# EAGLE design CM_VGA (EAGLE 5.04)
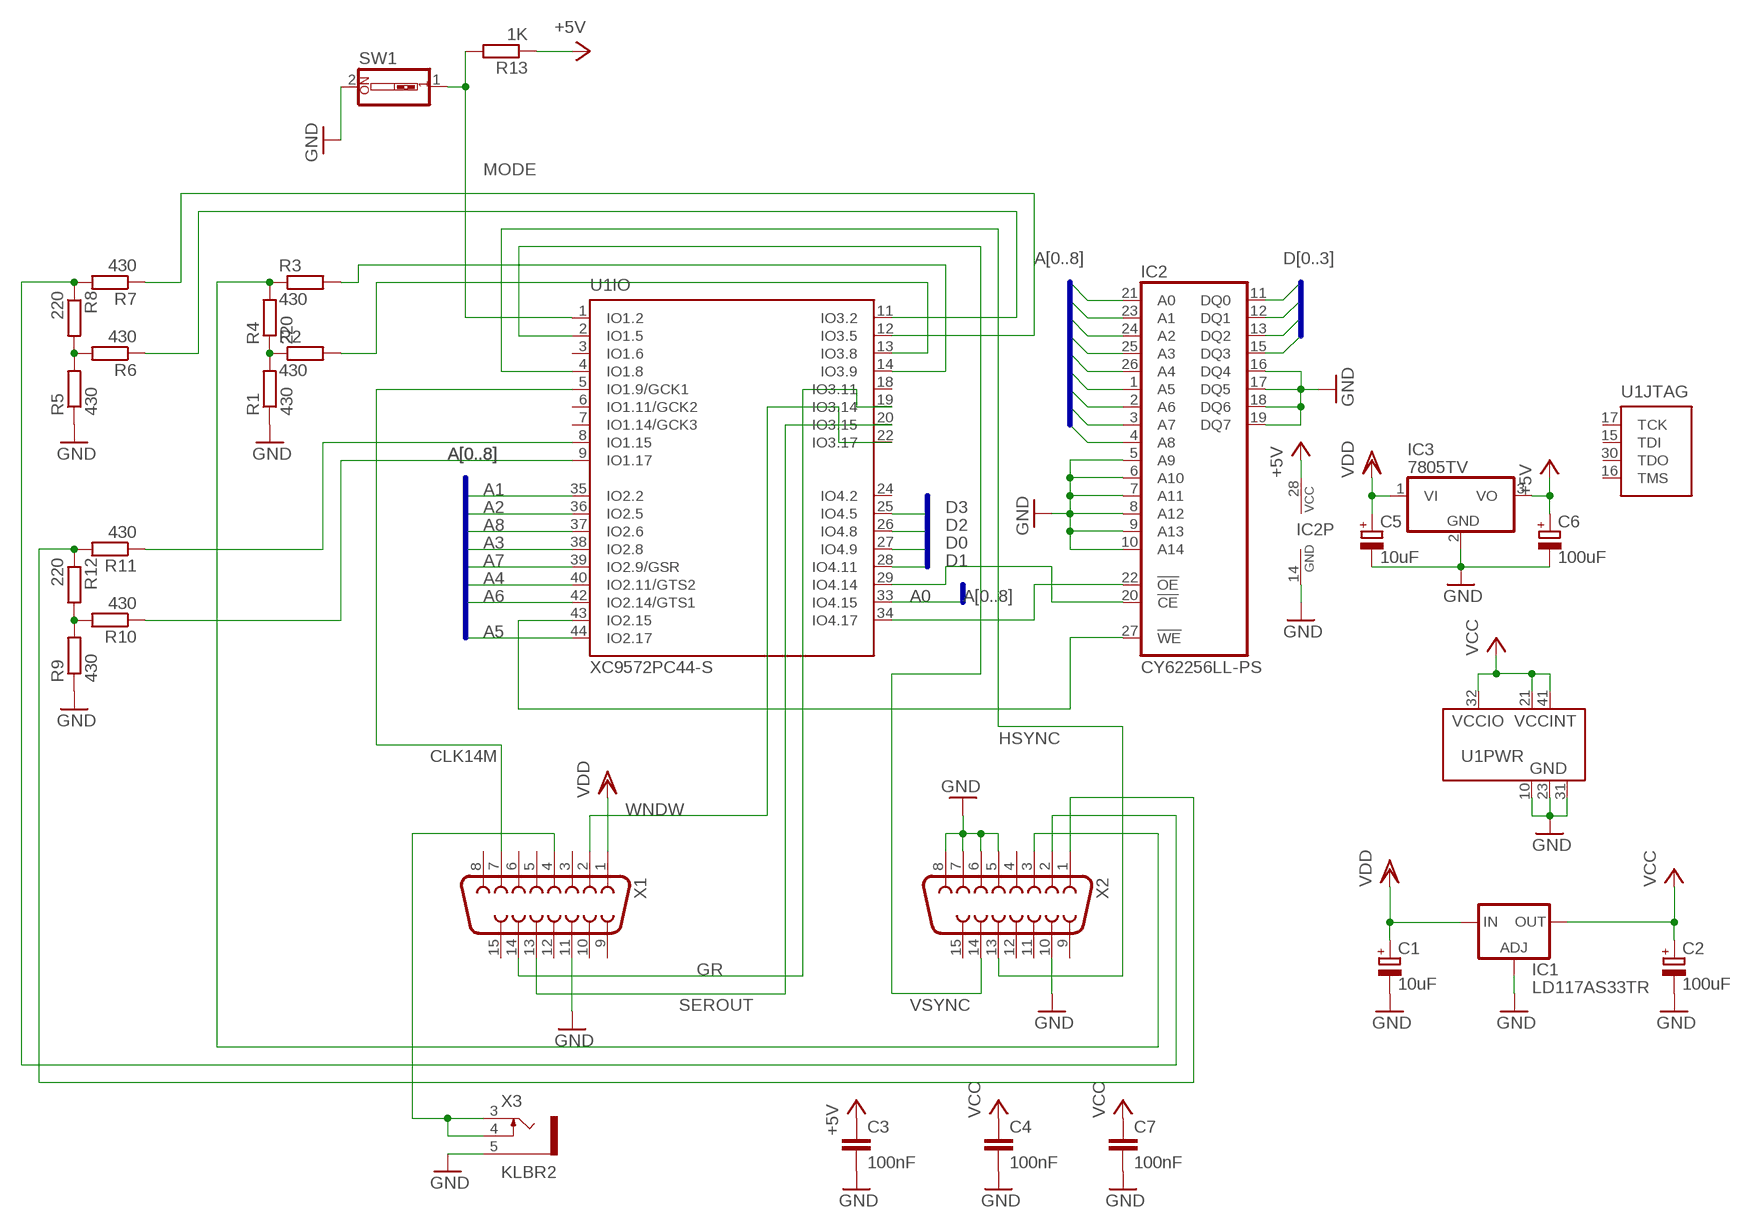
[diagram p0: schematic, sheet 1]

## Parts
C1  10uF  CPOL-EUE2.5-7  [E2,5-7]
C2  100uF  CPOL-EUE2.5-7  [E2,5-7]
C3  100nF  C-EU050-024X044  [C050-024X044]
C4  100nF  C-EU050-024X044  [C050-024X044]
C5  10uF  CPOL-EUE2.5-7  [E2,5-7]
C6  100uF  CPOL-EUE2.5-7  [E2,5-7]
C7  100nF  C-EU050-024X044  [C050-024X044]
IC1  LD117AS33TR  [SOT223]
IC2  CY62256LL-PS  [DIL28-3]
IC3  7805TV  [TO220V]
R1  430  R-EU_0204/7  [0204/7]
R2  430  R-EU_0204/7  [0204/7]
R3  430  R-EU_0204/7  [0204/7]
R4  220  R-EU_0204/7  [0204/7]
R5  430  R-EU_0204/7  [0204/7]
R6  430  R-EU_0204/7  [0204/7]
R7  430  R-EU_0204/7  [0204/7]
R8  220  R-EU_0204/7  [0204/7]
R9  430  R-EU_0204/7  [0204/7]
R10  430  R-EU_0204/7  [0204/7]
R11  430  R-EU_0204/7  [0204/7]
R12  220  R-EU_0204/7  [0204/7]
R13  1K  R-EU_0204/7  [0204/7]
SW1  SW_DIP-1  [EDG-01]
U1  XC9572PC44-S  [PLCC44S]
X1  F15H  [F15H]
X2  F15HDH  [HDF15H]
X3  KLBR2  [KLBR2]

## Nets
+5V: C3.1 C6.+ IC2.28(VCC) IC3.3(VO) R13.1
A0: IC2.21(A0) U1.33(IO:IO4.15)
A1: IC2.23(A1) U1.35(IO:IO2.2)
A2: IC2.24(A2) U1.36(IO:IO2.5)
A3: IC2.25(A3) U1.38(IO:IO2.8)
A4: IC2.26(A4) U1.40(IO:IO2.11/GTS2)
A5: IC2.1(A5) U1.44(IO:IO2.17)
A6: IC2.2(A6) U1.42(IO:IO2.14/GTS1)
A7: IC2.3(A7) U1.39(IO:IO2.9/GSR)
A8: IC2.4(A8) U1.37(IO:IO2.6)
CLK14M: U1.5(IO:IO1.9/GCK1) X1.7
D0: IC2.11(DQ0) U1.27(IO:IO4.9)
D1: IC2.12(DQ1) U1.28(IO:IO4.11)
D2: IC2.13(DQ2) U1.26(IO:IO4.8)
D3: IC2.15(DQ3) U1.25(IO:IO4.5)
GND: C1.- C2.- C3.2 C4.2 C5.- C6.- C7.2 IC1.1(ADJ) IC2.5(A9) IC2.6(A10) IC2.7(A11) IC2.8(A12) IC2.9(A13) IC2.10(A14) IC2.14(GND) IC2.16(DQ4) IC2.17(DQ5) IC2.18(DQ6) IC2.19(DQ7) IC3.2(GND) R1.1 R5.1 R9.1 SW1.2 U1.10(PWR:GND) U1.23(PWR:GND) U1.31(PWR:GND) X1.11 X2.5 X2.6 X2.7 X2.8 X2.10 X3.5
GR: U1.19(IO:IO3.14) X1.14
HSYNC: U1.4(IO:IO1.8) X2.13
MODE: R13.2 SW1.1 U1.1(IO:IO1.2)
N$1: IC2.27(!WE) U1.43(IO:IO2.15)
N$2: IC2.22(!OE) U1.34(IO:IO4.17)
N$3: IC2.20(!CE) U1.29(IO:IO4.14)
N$5: R1.2 R2.1 R4.1
N$6: R3.1 R4.2 X2.3
N$7: R5.2 R6.2 R8.2
N$8: R7.2 R8.1 X2.2
N$9: R9.2 R10.2 R12.2
N$10: R11.2 R12.1 X2.1
N$11: X1.4 X3.3 X3.4
N$12: R2.2 U1.13(IO:IO3.8)
N$13: R3.2 U1.14(IO:IO3.9)
N$14: R11.1 U1.8(IO:IO1.15)
N$15: R6.1 U1.11(IO:IO3.2)
N$16: R7.1 U1.12(IO:IO3.5)
N$17: R10.1 U1.9(IO:IO1.17)
SEROUT: U1.20(IO:IO3.15) X1.13
VCC: C2.+ C4.1 C7.1 IC1.4(OUT) U1.21(PWR:VCCINT) U1.32(PWR:VCCIO) U1.41(PWR:VCCINT)
VDD: C1.+ C5.+ IC1.3(IN) IC3.1(VI) X1.1
VSYNC: U1.2(IO:IO1.5) X2.14
WNDW: U1.22(IO:IO3.17) X1.2
Unconnected: U1.3(IO:IO1.6) U1.6(IO:IO1.11/GCK2) U1.7(IO:IO1.14/GCK3) U1.15(JTAG:TDI) U1.16(JTAG:TMS) U1.17(JTAG:TCK) U1.18(IO:IO3.11) U1.24(IO:IO4.2) U1.30(JTAG:TDO) X1.3 X1.5 X1.6 X1.8 X1.9 X1.10 X1.12 X1.15 X2.4 X2.9 X2.11 X2.12 X2.15

## Buses
A[0..8]
D[0..3]

## Library data of the parts
C1 C2 C5 C6 = rcl:CPOL-EU: POLARIZED CAPACITOR, European symbol
C3 C4 C7 = rcl:C-EU: CAPACITOR, European symbol
IC1 = v-reg:LD117A?*: Low drop fixed and adjustable positive voltage regulators 1 A Source: http://www.st.com/stonline/products/literature/ds/7194/ld1117axx.pdf
IC2 = greg-memory-sram:CY62256LL-?*: 256K (32K x 8) CMOS-Static RAM Source: http://download.cypress.com.edgesuite.net/design_resources/datasheets/contents/cy62256_8.pdf
IC3 = linear:78*: Positive VOLTAGE REGULATOR Source: http://cache.national.com/ds/LM/LM78L05.pdf http://www.fairchildsemi.com/ds/LM/LM7805.pdf
R1-R13 = rcl:R-EU_: RESISTOR, European symbol
SW1 = special:SW_DIP-1: DIP SWITCH
U1 = apbteam_xilinx-cpld:XC9572*PC44: XC9572 In-System Programmable CPLD 72 macrocells
X1 X2 = con-subd:F15: SUB-D
X3 = con-lumberg:KLBR?: Jack connectors according to JISC 6560, 2.5mm / 3.5 mm Klinkensteckverbinder nach JISC 6560, 2.5mm / 3,5 mm Source: http://www.lumberg.com/Produkte/PDFs/KLBR2.pdf www.lumberg.com/Produkte/PDFs/KLBR1.pdf

## Board
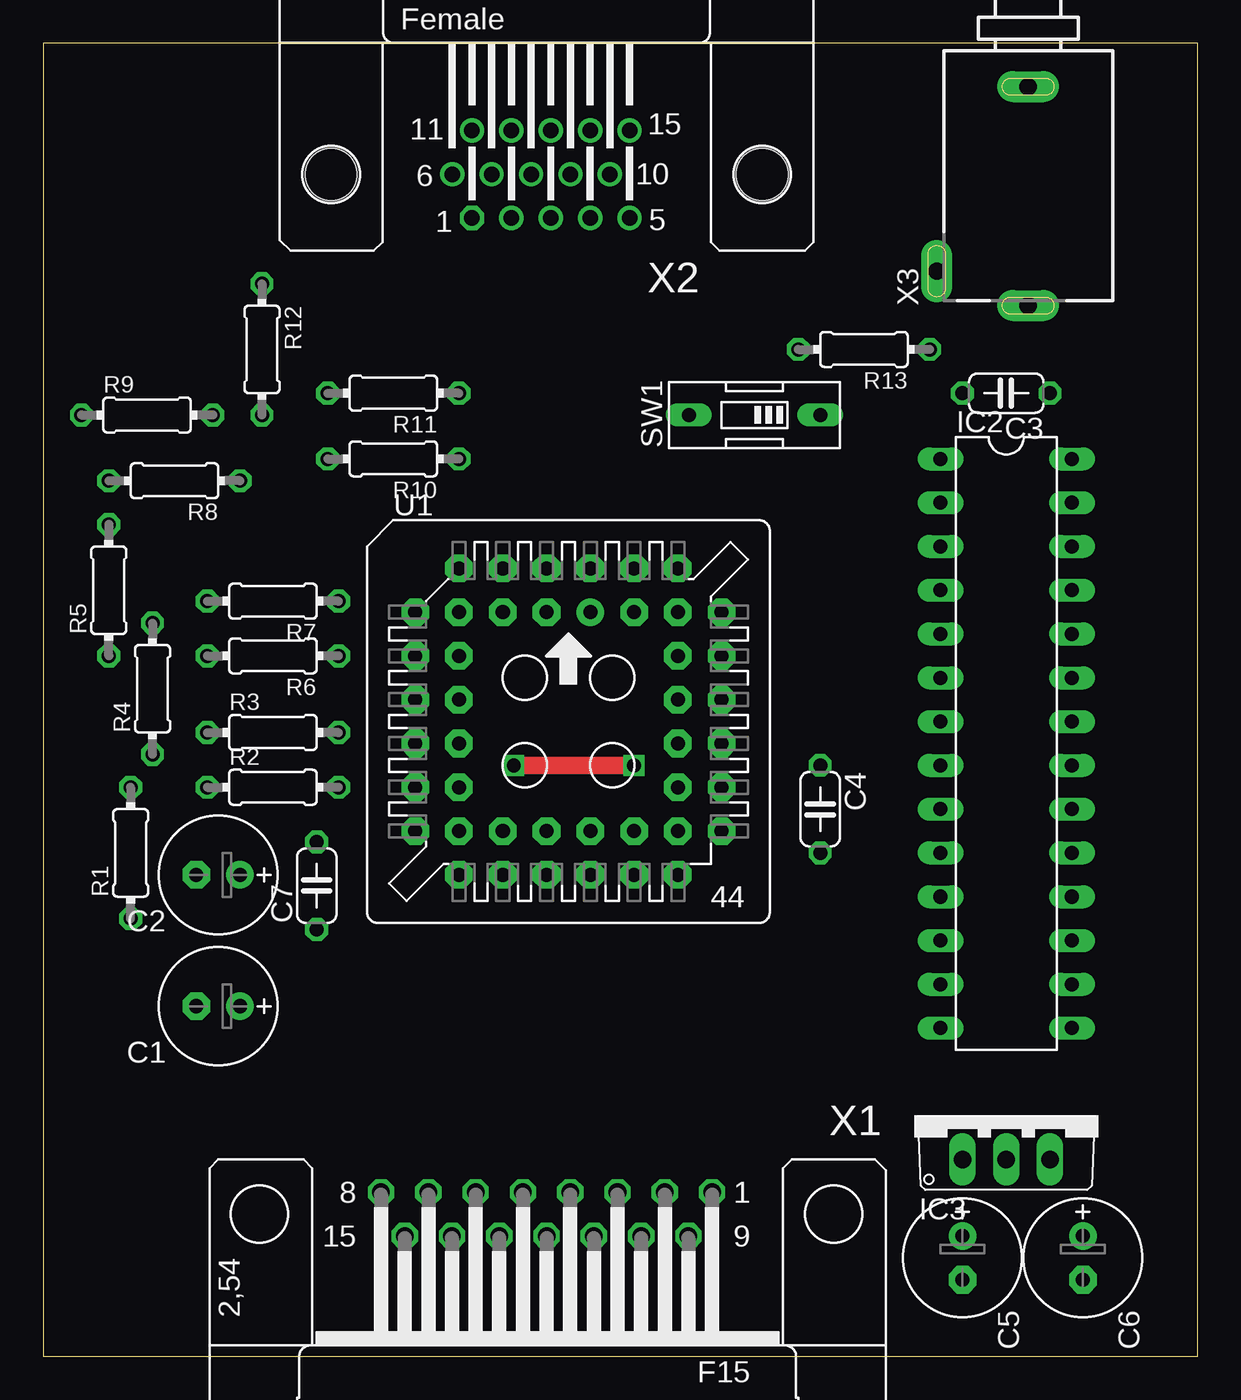
[diagram p1: board, top side]
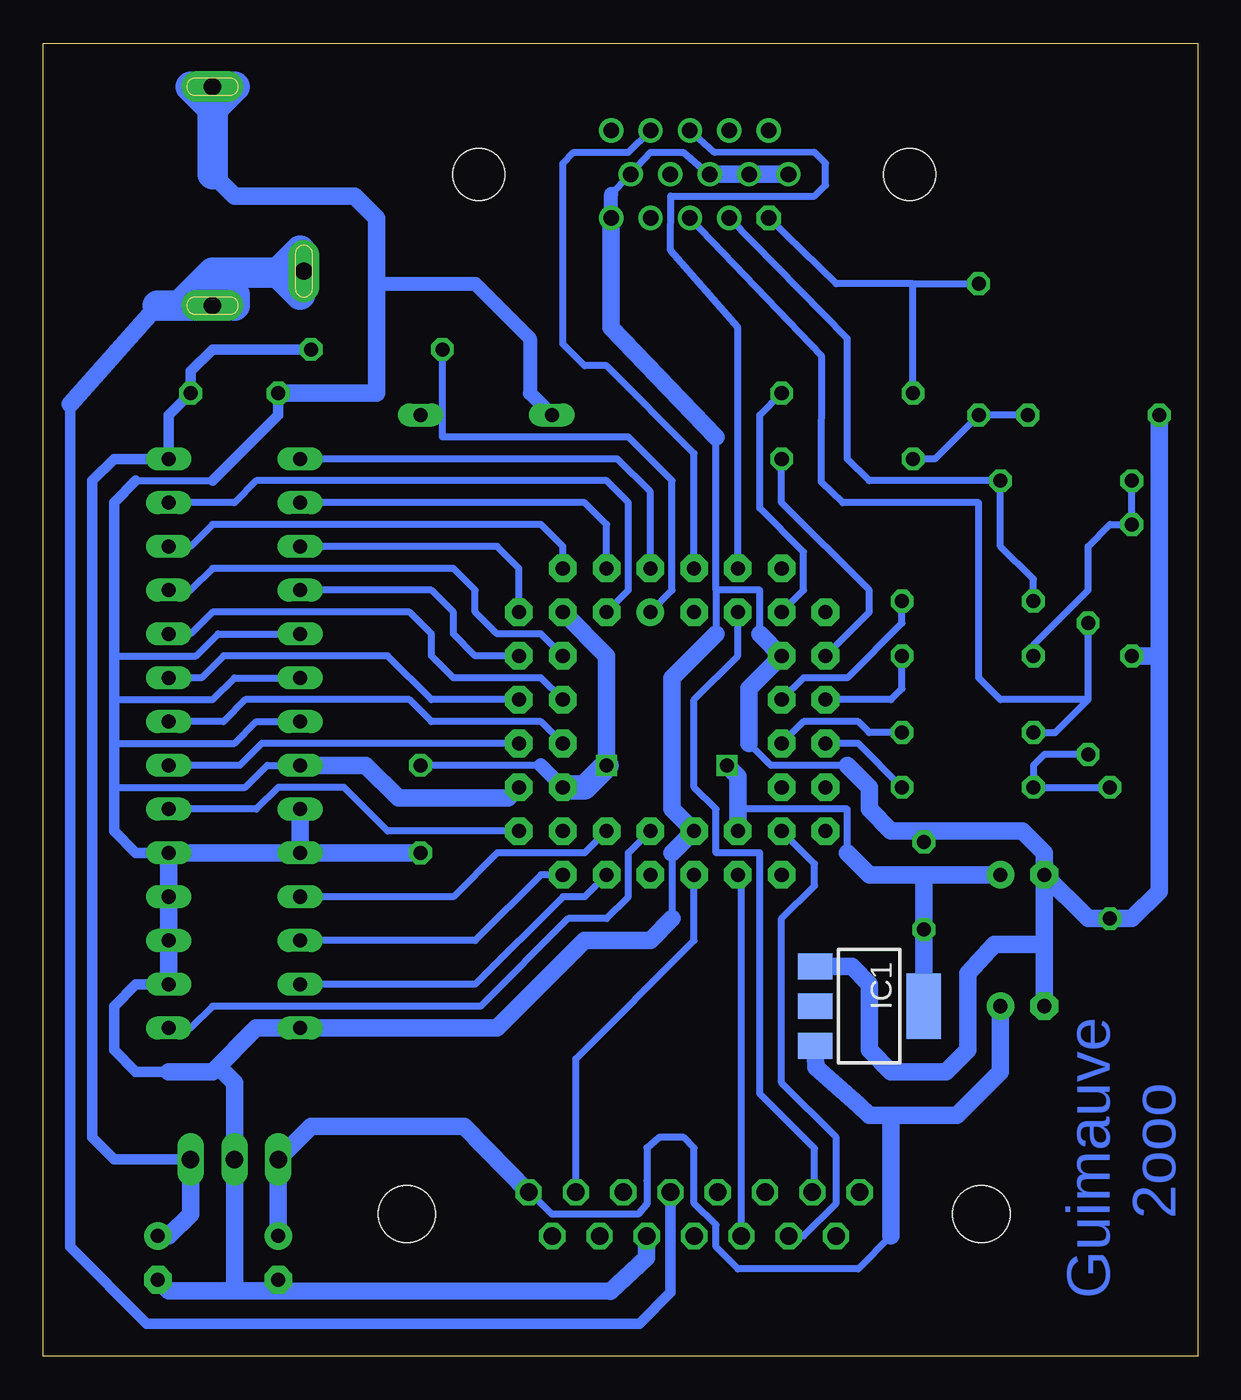
[diagram p2: board, bottom side, seen from below]

Size 66.98 x 76.19 mm. Coordinates in mm from the lower left corner, seen from the top.
Outline: 0,0 66.98,0 66.98,76.19 0,76.19 0,0
Copper layers (1*16): Top 0.035mm / dielectric 1.5mm / Bottom 0.035mm
Design rules "default": minimum track width 10mil, minimum drill 24mil, track to track 8mil, track to pad 8mil, pad to pad 8mil, via to via 8mil, smd to smd 8mil, copper to edge 40mil, drill to drill 8mil, minimum pad ring 10mil, minimum via ring 8mil, stop-mask expansion 4mil, vias tented up to drill 0mil, thermal gap 10mil

### Footprints (pad centres in the part's own frame; a part is rotated, then mirrored left to right if it is on the bottom)
E2,5-7 = drill 0.813 pad 1.6 round: + -1.27,0 | drill 0.813 pad 1.6 octagon: - 1.27,0
C050-024X044 = drill 0.813 octagon: 1 -2.54,0; 2 2.54,0
SOT223 = smd 1.5 x 2: 1 -2.3,-3.15; 2 0,-3.15; 3 2.3,-3.15 | smd 3.8 x 2: 4 0,3.15
DIL28-3 = drill 0.813 long: 1 -16.51,-3.81; 2 -13.97,-3.81; 3 -11.43,-3.81; 4 -8.89,-3.81; 5 -6.35,-3.81; 6 -3.81,-3.81; 7 -1.27,-3.81; 8 1.27,-3.81; 9 3.81,-3.81; 10 6.35,-3.81; 11 8.89,-3.81; 12 11.43,-3.81; 13 13.97,-3.81; 14 16.51,-3.81; 15 16.51,3.81; 16 13.97,3.81; 17 11.43,3.81; 18 8.89,3.81; 19 6.35,3.81; 20 3.81,3.81; 21 1.27,3.81; 22 -1.27,3.81; 23 -3.81,3.81; 24 -6.35,3.81; 25 -8.89,3.81; 26 -11.43,3.81; 27 -13.97,3.81; 28 -16.51,3.81
TO220V = drill 1.016 long: 1 -2.54,-2.54; 2 0,-2.54; 3 2.54,-2.54
0204/7 = drill 0.813 octagon: 1 -3.81,0; 2 3.81,0
EDG-01 = drill 0.813 long: 1 0,-3.81; 2 0,3.81
PLCC44S = drill 0.813 pad 1.6 round: 1 1.27,6.35 | drill 0.813 pad 1.6 octagon: 2 -1.27,8.89; 3 -1.27,6.35; 4 -3.81,8.89; 5 -3.81,6.35; 6 -6.35,8.89; 7 -8.89,6.35; 8 -6.35,6.35; 9 -8.89,3.81; 10 -6.35,3.81; 11 -8.89,1.27; 12 -6.35,1.27; 13 -8.89,-1.27; 14 -6.35,-1.27; 15 -8.89,-3.81; 16 -6.35,-3.81; 17 -8.89,-6.35; 18 -6.35,-8.89; 19 -6.35,-6.35; 20 -3.81,-8.89; 21 -3.81,-6.35; 22 -1.27,-8.89; 23 -1.27,-6.35; 24 1.27,-8.89; 25 1.27,-6.35; 26 3.81,-8.89; 27 3.81,-6.35; 28 6.35,-8.89; 29 8.89,-6.35; 30 6.35,-6.35; 31 8.89,-3.81; 32 6.35,-3.81; 33 8.89,-1.27; 34 6.35,-1.27; 35 8.89,1.27; 36 6.35,1.27; 37 8.89,3.81; 38 6.35,3.81; 39 8.89,6.35; 40 6.35,8.89; 41 6.35,6.35; 42 3.81,8.89; 43 3.81,6.35; 44 1.27,8.89
F15H = drill 1.016 octagon: 1 -9.601,-1.27; 2 -6.858,-1.27; 3 -4.115,-1.27; 4 -1.372,-1.27; 5 1.372,-1.27; 6 4.115,-1.27; 7 6.858,-1.27; 8 9.601,-1.27; 9 -8.23,1.27; 10 -5.486,1.27; 11 -2.743,1.27; 12 0,1.27; 13 2.743,1.27; 14 5.486,1.27; 15 8.23,1.27 | hole 3.302: -16.662,0; 16.662,0
HDF15H = drill 0.9 octagon: 1 4.329,2.54 | drill 0.9 round: 2 2.043,2.54; 3 -0.243,2.54; 4 -2.529,2.54; 5 -4.815,2.54; 6 5.472,0; 7 3.186,0; 8 0.9,0; 9 -1.386,0; 10 -3.672,0; 11 4.329,-2.54; 12 2.043,-2.54; 13 -0.243,-2.54; 14 -2.529,-2.54; 15 -4.815,-2.54 | hole 3: -12.5,0; 12.5,0
KLBR2 = drill 1 pad 1.8 long: 3 0,-6.35; 4 -5.3,-4.35; 5 0,6.35

### Placement (x,y rotation side)
C1  10.16,20.32 180 top
C2  10.16,27.94 180 top
C3  55.88,55.88 180 top
C4  45.09,31.75 270 top
C5  53.34,5.72 270 top
C6  60.32,5.72 270 top
C7  15.88,27.3 90 top
IC1  19.05,20.32 270 bottom
IC2  55.88,35.56 270 top
IC3  55.88,13.97 0 top
R1  5.08,29.21 90 top
R2  13.34,33.02 0 top
R3  13.34,36.2 0 top
R4  6.35,38.73 90 top
R5  3.81,44.45 90 top
R6  13.34,40.64 180 top
R7  13.34,43.81 180 top
R8  7.62,50.8 180 top
R9  6.03,54.61 0 top
R10  20.32,52.07 180 top
R11  20.32,55.88 180 top
R12  12.7,58.42 270 top
R13  47.62,58.42 180 top
SW1  41.27,54.61 90 top
U1  30.48,36.83 0 top
X1  29.21,8.25 180 top
X2  29.21,68.58 180 top
X3  57.15,67.31 0 top

### Tracks (layer width: path | path; a pad name or v marks a point on that pad's centre or on a via)
+5V
  Bottom 0.406: C6.+ 59.69,6.99
  Bottom 0.61: IC3.3 62.87,11.43 64.13,12.7 64.13,50.8 62.87,52.07 IC2.28 59.69,54.61 C3.1 58.42,57.15 57.15,58.42 R13.1
  Bottom 1.016: IC3.3 58.42,8.25 59.69,6.99
A0
  Bottom 0.406: U1.33 54.29,35.56 55.56,34.29 IC2.21
A1
  Bottom 0.406: U1.35 44.45,38.1 46.99,40.64 56.51,40.64 57.79,39.37 IC2.23
A2
  Bottom 0.406: U1.36 38.1,39.37 43.18,39.37 44.45,40.64 44.45,41.91 45.72,43.18 57.15,43.18 58.42,41.91 IC2.24
A3
  Bottom 0.406: U1.38 38.1,41.91 40.64,41.91 41.91,43.18 41.91,44.45 43.18,45.72 57.15,45.72 58.42,44.45 IC2.25
A4
  Bottom 0.406: U1.40 36.83,46.99 38.1,48.26 57.15,48.26 58.42,46.99 IC2.26
A5
  Bottom 0.406: U1.44 31.75,50.16 33.66,52.07 IC2.1
A6
  Bottom 0.406: U1.42 34.29,48.26 35.56,49.53 IC2.2
A7
  Bottom 0.406: U1.39 39.37,45.72 40.64,46.99 IC2.3
A8
  Bottom 0.406: U1.37 41.91,40.64 43.18,41.91 43.18,43.18 44.45,44.45 IC2.4
CLK14M
  Bottom 0.406: X1.7 22.23,9.52 22.23,12.07 25.4,15.24 25.4,29.21 27.94,29.21 27.94,31.75 29.21,33.02 29.21,38.1 26.67,40.64 U1.5
D0
  Bottom 0.406: U1.27 35.56,29.21 40.64,29.21 43.18,26.67 IC2.11
D1
  Bottom 0.406: U1.28 38.1,27.94 41.91,24.13 IC2.12
D2
  Bottom 0.406: U1.26 35.56,26.67 36.83,26.67 41.91,21.59 IC2.13
D3
  Bottom 0.406: U1.25 33.02,29.21 33.02,26.67 34.29,25.4 36.51,25.4 41.59,20.32 57.15,20.32 58.42,19.05 IC2.15
GND
  Bottom 0.406: 30.48,29.21 30.48,25.4 | IC2.5 56.83,41.91 58.1,40.64 62.87,40.64 | IC2.6 55.88,39.37 57.15,38.1 62.87,38.1 | IC2.7 54.61,36.83 55.88,35.56 62.87,35.56 | IC2.8 53.98,34.29 55.24,33.02 62.87,33.02 | IC2.10 IC2.9 | 27.94,44.45 27.94,41.91 | 27.94,44.45 25.4,44.45 25.4,41.91 | 26.03,35.56 24.77,34.29 20.32,34.29 | 27.94,44.45 27.94,53.34 | 34.03,65.76 X2.5 | 28.31,68.53 29.84,69.85 31.75,69.85 32.84,68.66 X2.10 32.82,68.66 32.96,68.53 34.02,67.44 | 20.04,22.6 20.05,22.62 | 55.88,3.81 53.34,3.81 | 31.96,6.94 X1.11 | 59.69,16.51 56.51,16.51 | 61.6,50.8 57.15,50.8
  Bottom 0.61: IC2.19 61.6,29.21 62.87,30.48 62.87,33.02 62.87,35.56 62.87,38.1 62.87,40.64 62.87,49.53 61.6,50.8 | 59.69,16.51 61.6,16.51 62.87,17.78 62.87,20.32 61.6,21.59 IC2.16 | 57.15,50.8 53.34,54.61 C3.2
  Bottom 0.813: 28.31,68.53 X2.8 | X2.5 34.02,67.44 | 47.62,62.23 41.91,62.23 38.73,59.05 38.73,55.88 SW1.2
  Bottom 1.016: U1.31 40.01,32.38 46.35,32.38 48.26,34.29 IC2.8 | 30.48,29.21 U1.23 30.48,31.75 30.48,39.37 27.94,41.91 | 30.48,25.4 31.75,24.13 35.56,24.13 40.64,19.05 IC2.14 54.61,19.05 57.15,16.51 59.69,16.51 | IC2.10 IC2.19 IC2.18 IC2.17 IC2.16 | IC2.10 IC2.9 | 25.4,41.91 U1.10 26.03,38.73 26.03,35.56 | 27.94,53.34 34.03,59.67 34.03,65.76 | X2.6 X2.7 X2.8 | 20.05,22.62 IC1.1 | 20.04,22.6 19.05,21.59 19.05,17.78 17.78,16.51 14.6,16.51 13.34,17.78 13.34,22.23 11.8,23.91 8.89,23.91 | C2.- 8.89,23.91 | 20.32,34.29 19.05,33.02 19.05,31.75 17.78,30.48 15.88,30.48 | C2.- 8.89,29.21 10.16,30.48 15.88,30.48 | 8.89,23.91 C1.- | C2.- 6.35,25.4 R1.1 3.81,25.4 2.22,26.99 2.22,40.64 | 2.22,40.64 R5.1 | 2.22,40.64 R9.1 | 57.15,68.58 55.88,67.31 48.9,67.31 47.62,66.04 47.62,62.23 47.62,55.88 C3.2 | IC2.10 C4.2 | 55.88,3.81 IC3.2 55.88,15.88 56.51,16.51 | 53.34,3.81 C5.- | 53.34,3.81 34.06,3.78 31.96,5.72 31.96,6.94 | 53.34,3.81 59.69,3.81 C6.- | 15.88,30.48 C7.2
  Bottom 1.778: 57.15,68.58 57.15,72.39 | 57.15,72.39 55.88,73.66 X3.5 | X3.5 58.42,73.66 57.15,72.39 | 57.15,72.39 X3.5
GR
  Bottom 0.406: X1.14 22.86,6.99 20.95,8.89 20.95,12.7 24.13,15.88 24.13,25.4 22.23,27.3 22.23,28.57 U1.19
HSYNC
  Bottom 0.406: X2.13 29.47,71.13 28.03,69.83 22.23,69.85 21.59,69.21 21.59,67.94 22.23,67.31 30.56,67.31 30.57,64.16 26.67,59.69 U1.4
MODE
  Bottom 0.406: 43.82,54.61 R13.2 | U1.1 30.48,44.45 30.48,50.8 33.02,53.34 43.82,53.34 43.82,54.61 | SW1.1 43.82,54.61
N$1
  Bottom 0.406: U1.43 33.02,44.45 33.02,49.53 34.29,50.8 54.61,50.8 55.88,49.53 IC2.27
N$2
  Bottom 0.406: IC2.22 56.51,36.83 55.24,38.1 45.72,38.1 44.45,36.83 38.1,36.83 U1.34
N$3
  Bottom 0.406: U1.29 46.99,30.48 49.53,33.02 53.34,33.02 54.61,31.75 IC2.20
N$5
  Bottom 0.406: R1.2 R2.1 9.52,34.29 8.89,34.93 R4.1
N$6
  Bottom 0.406: R3.1 8.25,36.2 6.35,38.1 | 6.35,38.1 R4.2 | X2.3 21.81,58.02 21.83,50.73 20.58,49.53 12.7,49.53 12.7,39.37 11.43,38.1 6.35,38.1
N$7
  Bottom 0.406: R6.2 9.52,41.27 6.35,44.45 6.35,46.99 5.08,48.26 R5.2 R8.2
N$8
  Bottom 0.406: R7.2 9.52,45.09 11.43,46.99 R8.1 19.05,50.8 20.32,52.07 20.32,59.05 X2.2
N$9
  Bottom 0.406: R9.2 R12.2 15.24,52.07 R10.2
N$10
  Bottom 0.406: 16.51,62.23 R12.1 | 16.51,62.23 20.95,62.23 X2.1 | R11.2 16.51,62.23
N$11
  Bottom 0.61: X1.4 30.58,3.71 32.38,1.91 60.96,1.91 65.41,6.35 65.41,55.24
  Bottom 1.016: 65.41,55.24 60.32,60.96
  Bottom 1.778: 60.32,60.96 59.05,60.96 | 59.05,60.96 X3.3 | 53.34,62.87 52.07,64.13 52.07,61.6 53.34,62.87 | 53.34,62.87 51.95,62.87 X3.4 | 57.15,62.87 53.34,62.87 | 57.15,62.87 57.15,62.23 55.88,60.96 55.88,61.6 57.15,62.87 | 59.05,60.96 57.15,62.87
N$12
  Bottom 0.406: R2.2 19.69,35.56 U1.13
N$13
  Bottom 0.406: R3.2 19.05,36.2 19.69,36.83 22.86,36.83 U1.14
N$14
  Bottom 0.406: R11.1 25.4,54.61 25.4,49.21 22.86,46.67 22.86,44.45 U1.8
N$15
  Bottom 0.406: R6.1 17.15,38.73 17.78,38.1 U1.11
N$16
  Bottom 0.406: R7.1 17.15,42.55 20.32,39.37 22.86,39.37 U1.12
N$17
  Bottom 0.406: R10.1 24.13,49.53 19.05,44.45 19.05,43.18 U1.9
SEROUT
  Bottom 0.406: X1.13 26.47,27.74 U1.20
VCC  (via drill 0.8)
  Top 1.016: v27.3,34.29 v34.29,34.29
  Bottom 0.406: 20.32,29.21 20.32,31.75 26.67,31.75 | 38.1,34.29 C4.1
  Bottom 0.813: U1.32 38.1,34.29
  Bottom 1.016: U1.41 34.29,40.64 v34.29,34.29 | U1.21 26.67,31.75 26.67,33.66 v27.3,34.29 | IC1.4 15.89,24.13 | 15.89,24.13 15.88,27.94 | 15.88,27.94 19.05,27.94 20.32,29.21 | 15.88,27.94 C2.+ | C7.1 15.88,24.14 15.89,24.13
  Bottom 1.422: U1.32 35.56,33.02 v34.29,34.29
VDD
  Bottom 0.406: X1.1 38.73,9.52 37.46,8.25 32.45,8.25 31.96,8.81 31.96,10.2 31.96,12.11 31.26,12.7 29.81,12.7 29.2,12.1 29.21,12.1 29.21,8.89 27.94,7.62 27.94,6.35 26.67,5.08 19.69,5.08 17.78,6.99
  Bottom 1.016: X1.1 42.55,13.34 51.43,13.34 IC3.1 C5.+ | 17.78,6.99 17.78,13.97 | 17.78,13.97 19.05,13.97 19.69,14.61 22.14,16.77 IC1.3 | C1.+ 11.43,16.51 13.97,13.97 17.78,13.97
VSYNC
  Bottom 0.406: X2.14 33.02,69.85 36.2,69.85 36.83,69.21 36.83,58.74 35.56,57.47 34.29,57.47 29.21,52.39 U1.2
WNDW
  Bottom 0.406: X1.2 36.07,17.27 29.21,24.13 U1.22

### Text on the board
Bottom: Guimauve | 2ooo